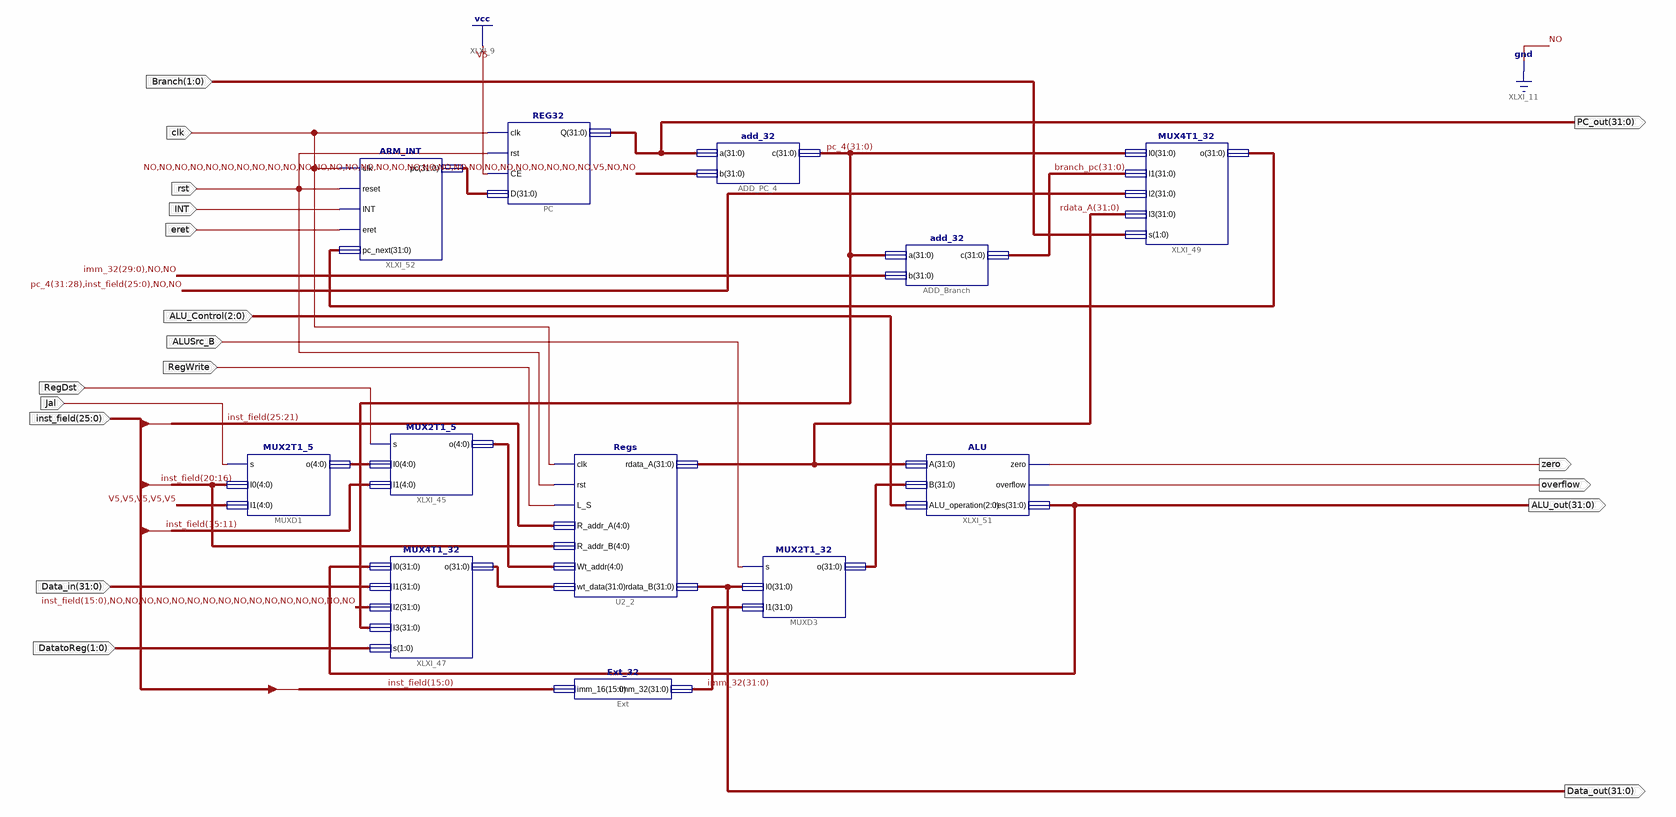
[diagram p0: schematic sheet 1]
// Xilinx ISE schematic Data_path.sch (kintex7) as structural Verilog: 12 symbols, 18 ports
module Data_path (
  input  RegWrite,
  input  [1:0] DatatoReg,
  input  [31:0] Data_in,
  input  ALUSrc_B,
  input  [2:0] ALU_Control,
  input  rst,
  input  [1:0] Branch,
  input  clk,
  input  Jal,
  input  [25:0] inst_field,
  input  RegDst,
  input  INT,
  input  eret,
  output [31:0] Data_out,
  output [31:0] ALU_out,
  output [31:0] PC_out,
  output overflow,
  output zero
);

  wire [4:0] XLXN_113, XLXN_114;
  wire [31:0] branch_pc, imm_32, pc_4, rdata_A, XLXN_3, XLXN_5, XLXN_129, XLXN_132;

  Regs U2_2 (
    .clk(clk), .rst(rst), .L_S(RegWrite), .R_addr_A(inst_field[25:21]), .R_addr_B(inst_field[20:16]),
    .Wt_addr(XLXN_114), .wt_data(XLXN_5), .rdata_A(rdata_A), .rdata_B(Data_out));
  MUX2T1_32 MUXD3 (.s(ALUSrc_B), .I0(Data_out), .I1(imm_32), .o(XLXN_3));
  Ext_32 Ext (.imm_16(inst_field[15:0]), .imm_32(imm_32));
  add_32 ADD_PC_4 (.a(PC_out), .b(32'b00000000000000000000000000000100), .c(pc_4));
  add_32 ADD_Branch (.a(pc_4), .b({imm_32[29:0], 2'b00}), .c(branch_pc));
  REG32 PC (.clk(clk), .rst(rst), .CE(1'b1), .D(XLXN_132), .Q(PC_out));
  MUX2T1_5 MUXD1 (.s(Jal), .I0(inst_field[20:16]), .I1({5{1'b1}}), .o(XLXN_113));
  MUX2T1_5 XLXI_45 (.s(RegDst), .I0(XLXN_113), .I1(inst_field[15:11]), .o(XLXN_114));
  MUX4T1_32 XLXI_47 (
    .I0(ALU_out), .I1(Data_in), .I2({inst_field[15:0], {16{1'b0}}}), .I3(pc_4), .s(DatatoReg), .o(XLXN_5));
  MUX4T1_32 XLXI_49 (
    .I0(pc_4), .I1(branch_pc), .I2({pc_4[31:28], inst_field, 2'b00}), .I3(rdata_A), .s(Branch), .o(XLXN_129));
  ALU XLXI_51 (.A(rdata_A), .B(XLXN_3), .ALU_operation(ALU_Control), .zero(zero), .overflow(overflow), .res(ALU_out));
  ARM_INT XLXI_52 (.clk(clk), .reset(rst), .INT(INT), .eret(eret), .pc_next(XLXN_129), .pc(XLXN_132));
endmodule
